# Altium schematic sheet PCIe_UART_Bridge.SchDoc
size A; SheetNumber: 3; SheetTotal: 12
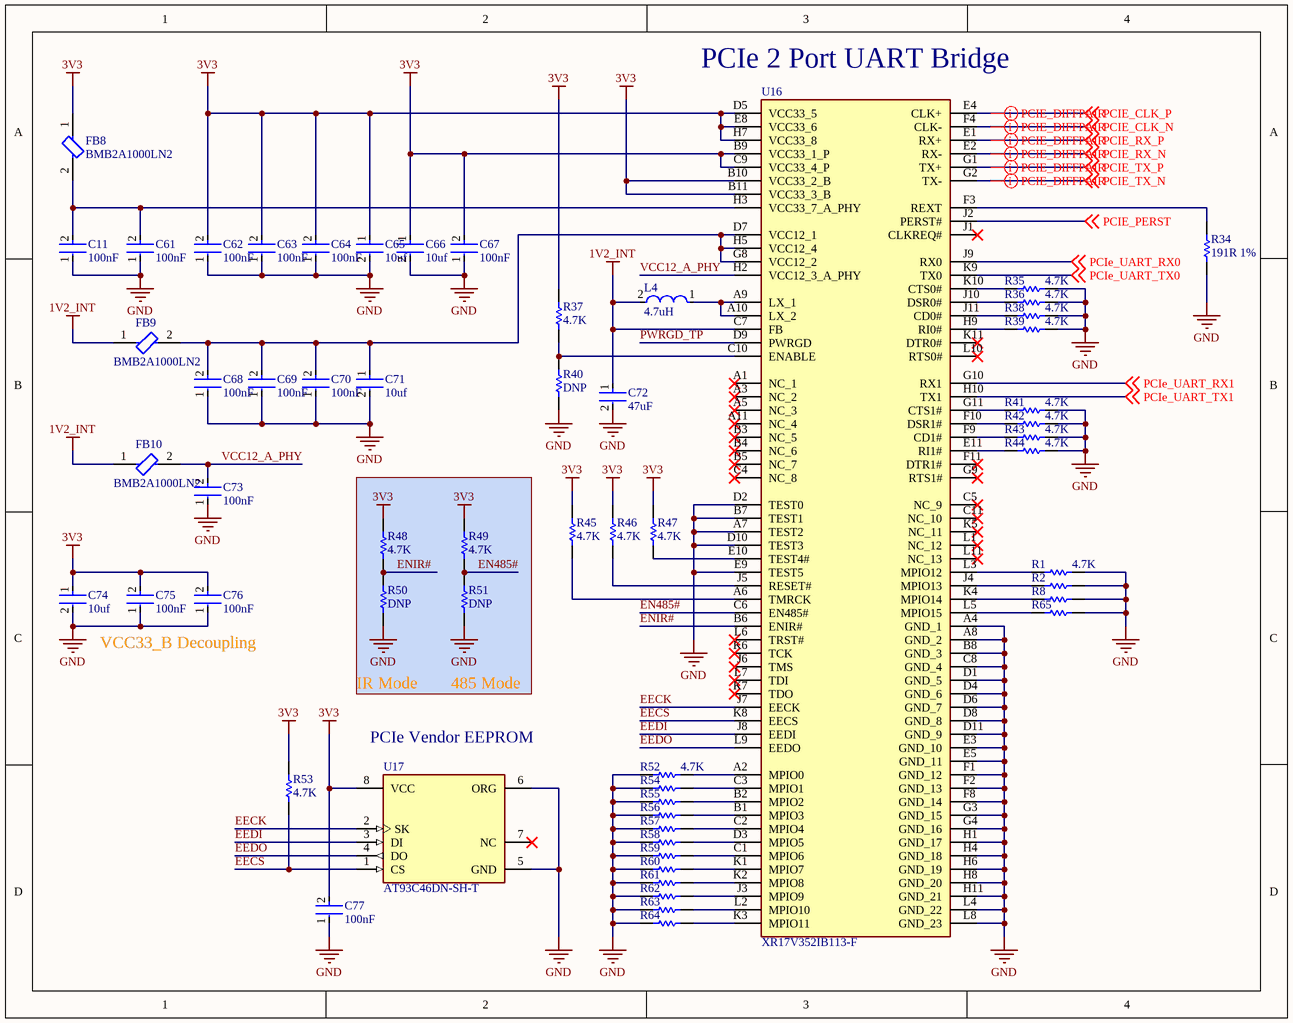
[diagram p0: PCIe_UART_Bridge.SchDoc]

## Parts
C11  100nF  [FP-GRM15-MFG]
C61  100nF  [FP-GRM15-MFG]
C62  100nF  [FP-GRM15-MFG]
C63  100nF  [FP-GRM15-MFG]
C64  100nF  [FP-GRM15-MFG]
C65  10uf  [FP-GRM188-0_2-IPC_C]
C66  10uf  [FP-GRM188-0_2-IPC_C]
C67  100nF  [FP-GRM15-MFG]
C68  100nF  [FP-GRM15-MFG]
C69  100nF  [FP-GRM15-MFG]
C70  100nF  [FP-GRM15-MFG]
C71  10uf  [FP-GRM188-0_2-IPC_C]
C72  47uF  [FP-C2012-125-0_2-IPC_B]
C73  100nF  [FP-GRM15-MFG]
C74  10uf  [FP-GRM188-0_2-IPC_C]
C75  100nF  [FP-GRM15-MFG]
C76  100nF  [FP-GRM15-MFG]
C77  100nF  [FP-GRM15-MFG]
FB8  BMB2A1000LN2  [FP-BMB2A1000LN2-IPC_C]
FB9  BMB2A1000LN2  [FP-BMB2A1000LN2-IPC_C]
FB10  BMB2A1000LN2  [FP-BMB2A1000LN2-IPC_C]
L4  4.7uH  [FP-NR3012-MFG]
R1  4.7K  [RESC1005X40X25LL05T05]
R2  4.7K  [RESC1005X40X25LL05T05]  (value not drawn)
R8  4.7K  [RESC1005X40X25LL05T05]  (value not drawn)
R34  191R 1%  [RESC1005X40X25ML05T05]
R35  4.7K  [RESC1005X40X25LL05T05]
R36  4.7K  [RESC1005X40X25LL05T05]
R37  4.7K  [RESC1005X40X25LL05T05]
R38  4.7K  [RESC1005X40X25LL05T05]
R39  4.7K  [RESC1005X40X25LL05T05]
R40  DNP  [RESC1005X40X25LL05T05]
R41  4.7K  [RESC1005X40X25LL05T05]
R42  4.7K  [RESC1005X40X25LL05T05]
R43  4.7K  [RESC1005X40X25LL05T05]
R44  4.7K  [RESC1005X40X25LL05T05]
R45  4.7K  [RESC1005X40X25LL05T05]
R46  4.7K  [RESC1005X40X25LL05T05]
R47  4.7K  [RESC1005X40X25LL05T05]
R48  4.7K  [RESC1005X40X25LL05T05]
R49  4.7K  [RESC1005X40X25LL05T05]
R50  DNP  [RESC1005X40X25LL05T05]
R51  DNP  [RESC1005X40X25LL05T05]
R52  4.7K  [RESC1005X40X25LL05T05]
R53  4.7K  [RESC1005X40X25LL05T05]
R54  4.7K  [RESC1005X40X25LL05T05]  (value not drawn)
R55  4.7K  [RESC1005X40X25LL05T05]  (value not drawn)
R56  4.7K  [RESC1005X40X25LL05T05]  (value not drawn)
R57  4.7K  [RESC1005X40X25LL05T05]  (value not drawn)
R58  4.7K  [RESC1005X40X25LL05T05]  (value not drawn)
R59  4.7K  [RESC1005X40X25LL05T05]  (value not drawn)
R60  4.7K  [RESC1005X40X25LL05T05]  (value not drawn)
R61  4.7K  [RESC1005X40X25LL05T05]  (value not drawn)
R62  4.7K  [RESC1005X40X25LL05T05]  (value not drawn)
R63  4.7K  [RESC1005X40X25LL05T05]  (value not drawn)
R64  4.7K  [RESC1005X40X25LL05T05]  (value not drawn)
R65  4.7K  [RESC1005X40X25LL05T05]  (value not drawn)
U16  XR17V352IB113-F  [BGA113C80P11X11_900X900X153]
U17  AT93C46DN-SH-T  [FP-C04-057-SN-MFG]

## Nets
1V2_INT: C72.1 FB9.1 FB10.1 L4.2 U16.C7(FB)
3V3: C62.2 C63.2 C64.2 C65.1 C66.1 C67.2 C74.1 C75.2 C76.2 C77.2 FB8.1 R37.2 R45.2 R46.2 R47.2 R48.2 R49.2 R53.2 U16.B9(VCC33_1_P) U16.B10(VCC33_2_B) U16.B11(VCC33_3_B) U16.C9(VCC33_4_P) U16.D5(VCC33_5) U16.E8(VCC33_6) U16.H7(VCC33_8) U17.8(VCC)
GND: C11.1 C61.1 C62.1 C63.1 C64.1 C65.2 C66.2 C67.1 C68.1 C69.1 C70.1 C71.2 C72.2 C73.1 C74.2 C75.1 C76.1 C77.1 R1.1 R2.1 R8.1 R34.2 R35.1 R36.1 R38.1 R39.1 R40.1 R41.1 R42.1 R43.1 R44.1 R50.1 R51.1 R52.2 R54.2 R55.2 R56.2 R57.2 R58.2 R59.2 R60.2 R61.2 R62.2 R63.2 R64.2 R65.1 U16.A4(GND_1) U16.A7(TEST2) U16.A8(GND_2) U16.B7(TEST1) U16.B8(GND_3) U16.C8(GND_4) U16.D1(GND_5) U16.D2(TEST0) U16.D4(GND_6) U16.D6(GND_7) U16.D8(GND_8) U16.D10(TEST3) U16.D11(GND_9) U16.E3(GND_10) U16.E5(GND_11) U16.E9(TEST5) U16.F1(GND_12) U16.F2(GND_13) U16.F8(GND_14) U16.G3(GND_15) U16.G4(GND_16) U16.H1(GND_17) U16.H4(GND_18) U16.H6(GND_19) U16.H8(GND_20) U16.H11(GND_21) U16.L4(GND_22) U16.L8(GND_23) U17.5(GND) U17.6(ORG)
EECK: U16.J7(EECK) U17.2(SK)
EECS: R53.1 U16.K8(EECS) U17.1(CS)
EEDI: U16.J8(EEDI) U17.3(DI)
EEDO: U16.L9(EEDO) U17.4(DO)
EN485#: R49.1 R51.2 U16.C6(EN485#)
ENIR#: R48.1 R50.2 U16.B6(ENIR#)
PCIE_CLK_N: U16.F4(CLK-) ; off-sheet PCIE_CLK_N
PCIE_CLK_P: U16.E4(CLK+) ; off-sheet PCIE_CLK_P
PCIE_PERST: U16.J2(PERST#) ; off-sheet PCIE_PERST
PCIE_RX_N: U16.E2(RX-) ; off-sheet PCIE_RX_N
PCIE_RX_P: U16.E1(RX+) ; off-sheet PCIE_RX_P
PCIE_TX_N: U16.G2(TX-) ; off-sheet PCIE_TX_N
PCIE_TX_P: U16.G1(TX+) ; off-sheet PCIE_TX_P
PCIe_UART_RX0: U16.J9(RX0) ; off-sheet PCIe_UART_RX0
PCIe_UART_RX1: U16.G10(RX1) ; off-sheet PCIe_UART_RX1
PCIe_UART_TX0: U16.K9(TX0) ; off-sheet PCIe_UART_TX0
PCIe_UART_TX1: U16.H10(TX1) ; off-sheet PCIe_UART_TX1
PWRGD_TP: U16.D9(PWRGD)
VCC12_A_PHY: C73.2 FB10.2 U16.H2(VCC12_3_A_PHY)
NetC11_2: C11.2 C61.2 FB8.2 U16.H3(VCC33_7_A_PHY)
NetC68_2: C68.2 C69.2 C70.2 C71.1 FB9.2 U16.D7(VCC12_1) U16.G8(VCC12_2) U16.H5(VCC12_4)
NetL4_1: L4.1 U16.A9(LX_1) U16.A10(LX_2)
NetR1_2: R1.2 U16.L3(MPIO12)
NetR2_2: R2.2 U16.J4(MPIO13)
NetR8_2: R8.2 U16.K4(MPIO14)
NetR34_1: R34.1 U16.F3(REXT)
NetR35_2: R35.2 U16.K10(CTS0#)
NetR36_2: R36.2 U16.J10(DSR0#)
NetR37_1: R37.1 R40.2 U16.C10(ENABLE)
NetR38_2: R38.2 U16.J11(CD0#)
NetR39_2: R39.2 U16.H9(RI0#)
NetR41_2: R41.2 U16.G11(CTS1#)
NetR42_2: R42.2 U16.F10(DSR1#)
NetR43_2: R43.2 U16.F9(CD1#)
NetR44_2: R44.2 U16.E11(RI1#)
NetR45_1: R45.1 U16.A6(TMRCK)
NetR46_1: R46.1 U16.J5(RESET#)
NetR47_1: R47.1 U16.E10(TEST4#)
NetR52_1: R52.1 U16.A2(MPIO0)
NetR54_1: R54.1 U16.C3(MPIO1)
NetR55_1: R55.1 U16.B2(MPIO2)
NetR56_1: R56.1 U16.B1(MPIO3)
NetR57_1: R57.1 U16.C2(MPIO4)
NetR58_1: R58.1 U16.D3(MPIO5)
NetR59_1: R59.1 U16.C1(MPIO6)
NetR60_1: R60.1 U16.K1(MPIO7)
NetR61_1: R61.1 U16.K2(MPIO8)
NetR62_1: R62.1 U16.J3(MPIO9)
NetR63_1: R63.1 U16.L2(MPIO10)
NetR64_1: R64.1 U16.K3(MPIO11)
NetR65_2: R65.2 U16.L5(MPIO15)

Not connected (* = marked no-connect by the designer): U16 A1(NC_1)* A3(NC_2)* A5(NC_3)* A11(NC_4)* B3(NC_5)* B4(NC_6)* B5(NC_7)* C4(NC_8)* C5(NC_9)* C11(NC_10)* F11(DTR1#)* G9(RTS1#)* J1(CLKREQ#)* J6(TMS)* K5(NC_11)* K6(TCK)* K7(TDO)* K11(DTR0#)* L1(NC_12)* L6(TRST#)* L7(TDI)* L10(RTS0#)* L11(NC_13)*; U17 7(NC)*

## Layout directives
differential pair; differential pair class PCIe: PCIE_CLK_N, PCIE_CLK_P, PCIE_RX_N, PCIE_RX_P, PCIE_TX_N, PCIE_TX_P

## Notes on the sheet
- (near U16) PCIe 2 Port UART Bridge
- VCC33_B Decoupling
- IR Mode
- 485 Mode
- (near U17) PCIe Vendor EEPROM

## Library data of the parts
C11 C61-C64 C67-C70 C73 C75-C77 = CMP-2100-03641-2: CAP CER 0.1UF 16V X7R 0402; Manufacturer Part Number: GRM155R71C104KA88D; Manufacturer: Murata; Standoff Height: 0mm; Tolerance: 10%; Voltage Rating: 16Vdc; Material: Ceramic; Capacitance: 0.10μF; Value: 0.10μF; RoHS: TRUE; Temperature Characteristic: X7R; Octopart: https://octopart.com/grm155r71c104ka88d-murata-196880; Digikey Description: CAP CER 0.1UF 16V X7R 0402; Device Class L3: Ceramic Capacitors; Height: 0.55mm; ComponentLink2Description: Datasheet; Temperature Range Low: -55°C; Ipc Land Pattern Name: CAPC10050X219; ComponentLink2URL: https://search.murata.co.jp/Ceramy/image/img/A01X/G101/ENG/GRM155R71H471KA01-01A.pdf; Device Class L1: Passive Components; Lead Free: yes; Category: Cap; Package: GRM15; Temperature: -55°C to +125°C; Device Class L2: Capacitors; Temperature Range High: +125°C; Mouser Description: 0402 0.1 uF 16V ±10 % Tolerance X7R SMT Multilayer Ceramic Capacitor
C65 C66 C71 C74 = CMP-06035-045466-1: Chip Multilayer Ceramic Capacitors for General Purpose, 0603, 10uF, X5R, 15%, 20%, 35V; Case Code (Imperial): 0603; Voltage Rating (DC): 35V; Width: 0.031inch; Dielectric: X5R; Voltage Rating: 35V; Min Operating Temperature: -55°C; Thickness: 0.039inch; Mount: Surface Mount; Case/Package: 0603; Length: 0.063inch; Capacitance: 10uF; Max Operating Temperature: 85°C; Packaging: Tape and Reel; Tolerance: 20%; Case Code (Metric): 1608
C72 = CMP-2000-05451-2: Multilayer Ceramic Capacitors 47μF ±20% 10V X5R SMD 0805; RoHS Compliant: Yes; Dielectric: X5R; Case Code (Imperial): 0805; Min Operating Temperature: -55°C; Capacitance: 47uF; Length: 2mm; Voltage Rating: 10V; Lead Free: Lead Free; Weight: 0.000194oz; Resistor Type: Ceramic; Dielectric Material: Ceramic; Max Operating Temperature: 85°C; Height: 1.25mm; Width: 0.049inch; Depth: 1.25mm; Termination: SMD/SMT; Case/Package: 0805; Voltage Rating (DC): 10V; Voltage: 10V; Thickness: 0.057inch; Tolerance: 20%; REACH SVHC: No SVHC; Package Quantity: 1; Series: C; Case Code (Metric): 2012; Mount: Surface Mount; Packaging: Tape and Reel
FB8-FB10 = CMP-03232-000001-1: FERRITE BEAD 1 KOHM 0805 1LN; Tolerance: 25%; Lead/Base Style: SMD/SMT; Max DC Current: 350mA; Number of Lines: 1; Impedance: 1kR; DC Resistance (DCR): 300mR; Resistor Type: Ferrite Bead; Depth: 1.4mm; Height: 1.1mm; Case/Package: 0805; Number of Pins: 2; Case Code (Imperial): 0805; ELV: Compliant; Packaging: Tape and Reel; Mount: Surface Mount; Max Current Rating: 350mA; Max Operating Temperature: 125°C; Series: BMB-L; Core Material: Ferrite; Min Operating Temperature: -55°C; RoHS Compliant: Yes; Case Code (Metric): 2012
L4 = CMP-14484-001484-1: SMD Power Inductors 4.7uH ±20% 0.77A 0.13Ω; Saturation Current: 770mA; Self Resonant Frequency: 48MHz; RMS Current (Irms): 980mA; Test Frequency: 100kHz; Core Material: Ferrite; Shielding: Shielded; DC Resistance (DCR): 156mR; Series: NR; Case Code (Metric): 3030; Halogen Free: Halogen Free; Tolerance: 20%; Resistor Type: Wirewound; Mount: Surface Mount; Case/Package: 1212; Max DC Current: 770mA; Length: 0.118inch; Height - Seated (Max): 0.047inch; Termination: SMD/SMT; Package Quantity: 2000; DC Current: 980mA; Depth: 3.1mm; Packaging: Tape and Reel; Height: 1.2mm; Current Rating: 980mA; Min Operating Temperature: -25°C; Case Code (Imperial): 1212; Lead Free: Lead Free; Military Standard: Not; Width: 0.118inch; Max Operating Temperature: 120°C; Radiation Hardening: No; Inductance: 4.7uH; Inductance Tolerance: 20%; RoHS Compliant: Yes
R1 R2 R8 R35-R39 R41-R65 = CMP-2002-01154-4: Chip Resistor, 4.7 KOhm, +/- 1%, 0.1 W, -55 to 155 degC, 0402 (1005 Metric), RoHS, Tape and Reel; PartNumber: ERJ-2RKF4701X; Voltage Rating: 50 V; Case\/Package: 0402; Power Rating: 100 mW; Height: 0.35 mm; Mounting Technology: Surface Mount; REACH SVHC: Yes; Resistance: 4.7 KOhm; Max Operating Temperature: 155 degC; ComponentLink1Description: Manufacturer URL; ComponentLink2Description: Datasheet; Pins: 2; PackageReference: 0402; Tolerance: 1%; Case Code (Imperial): 0402; Length: 1 mm; PackageDescription: 2-Pin Surface Mount Device, Body 1 x 0.5 mm; RoHSCompliant: true; Package Quantity: 1; Radiation Hardening: No; DatasheetVersion: 04/2015; Width: 0.5 mm; Case Code (Metric): 1005; Mount: Surface Mount; ComponentLink1URL: http://www.panasonic.com/; Min Operating Temperature: -55 degC; Packaging: Cut Tape; ComponentLink2URL: http://industrial.panasonic.com/cdbs/www-data/pdf/RDA0000/AOA0000C86.pdf
R34 = CMP-1011-00427-2: Manufacturer: Panasonic; Part Number: ERJ-2RKF1910X
R40 = CMP-2002-01154-4: PartNumber: ERJ-2RKF4701X; Resistance: 4.7 KOhm; Tolerance: 1%; Voltage Rating: 50 V; Case\/Package: 0402; Power Rating: 100 mW; Height: 0.35 mm; Mounting Technology: Surface Mount; REACH SVHC: Yes; Max Operating Temperature: 155 degC; ComponentLink1Description: Manufacturer URL; ComponentLink2Description: Datasheet; Pins: 2; PackageReference: 0402; Case Code (Imperial): 0402; Length: 1 mm; PackageDescription: 2-Pin Surface Mount Device, Body 1 x 0.5 mm; RoHSCompliant: true; Package Quantity: 1; Radiation Hardening: No; DatasheetVersion: 04/2015; Width: 0.5 mm; Case Code (Metric): 1005; Mount: Surface Mount; ComponentLink1URL: http://www.panasonic.com/; Min Operating Temperature: -55 degC; Packaging: Cut Tape; ComponentLink2URL: http://industrial.panasonic.com/cdbs/www-data/pdf/RDA0000/AOA0000C86.pdf
U16 = XR17V352IB113-F: Integrated Circuit; Manufacturer_Name: MaxLinear; Datasheet Link: https://www.mouser.com/datasheet/2/146/XR17V352-536180.pdf; Height: 1.53mm; Manufacturer_Part_Number: XR17V352IB113-F; Mouser Part Number: 701-XR17V352IB113-F; Mouser Price/Stock: https://www.mouser.co.uk/ProductDetail/MaxLinear/XR17V352IB113-F?qs=j9wFvaVy6jcT7uc4HigktQ%3D%3D; Arrow Part Number: XR17V352IB113-F; Arrow Price/Stock: https://www.arrow.com/en/products/xr17v352ib113-f/maxlinear-inc?region=nac
U17 = CMP-06313-000016-1: IC EEPROM 1K SPI 2MHZ 8SOIC; Manufacturer: Microchip; Nominal Supply Current: 0.5mA; Memory Size: 1Kbits; Access Time: 1000ns; Max Supply Voltage: 5.5V; Interface: Other; Standoff Height: 0.1mm; Min Supply Voltage: 1.8V; Category: IC; Temperature Range High: +85°C; Mouser Description: EEPROM Serial-3Wire 1K-Bit 128 x 8/64 x 16 2.5V/3.3V/5V 8-Pin SOIC T/R; Ipc Land Pattern Name: SOIC127P600X175-8; Temperature Range Low: -40°C; Temperature: -40°C to +85°C; Digikey Description: IC EEPROM 1K SPI 2MHZ 8SOIC; Lead Free: Yes; Device Class L2: Memory; ComponentLink2URL: http://ww1.microchip.com/downloads/en/DeviceDoc/20006224B.pdf; Automotive: No; Device Class L3: EEPROM; Package: C04-057-SN; Octopart: https://octopart.com/at93c46dn-sh-t-microchip-77759177; RoHS: TRUE; Memory Type: EEPROM; Height: 1.75mm; Manufacturer Part Number: AT93C46DN-SH-T; ComponentLink2Description: Datasheet; Frequency: 2MHz; Device Class L1: Integrated Circuits (ICs)